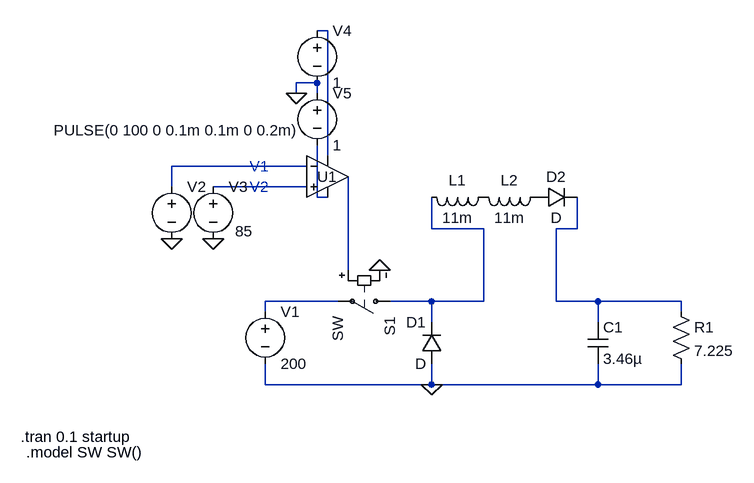
[diagram p0: schematic boostedInductor3.asc]
boostedInductor3.asc, the LTspice schematic file:
Version 4
SHEET 1 880 680
WIRE -48 -288 -64 -288
WIRE -64 -208 -96 -208
WIRE -96 -192 -96 -208
WIRE -64 -192 -64 -208
WIRE -48 -96 -48 -288
WIRE -80 -80 -288 -80
WIRE -288 -48 -288 -80
WIRE -80 -48 -224 -48
WIRE -64 -32 -64 -112
WIRE -48 -32 -64 -32
WIRE 112 16 112 -32
WIRE 192 16 112 16
WIRE 336 16 336 -32
WIRE 336 16 304 16
WIRE -16 80 -16 -64
WIRE -32 128 -144 128
WIRE 112 128 48 128
WIRE 192 128 192 16
WIRE 192 128 112 128
WIRE 304 128 304 16
WIRE 368 128 304 128
WIRE 496 128 368 128
WIRE -144 144 -144 128
WIRE 496 144 496 128
WIRE 112 160 112 128
WIRE 368 160 368 128
WIRE -144 256 -144 224
WIRE 112 256 112 224
WIRE 112 256 -144 256
WIRE 368 256 368 224
WIRE 368 256 112 256
WIRE 496 256 496 224
WIRE 496 256 368 256
FLAG 32 80 0
FLAG 112 256 0
FLAG -288 32 0
FLAG -224 32 0
FLAG -96 -192 0
SYMBOL voltage -144 128 R0
WINDOW 123 0 0 Left 2
WINDOW 39 0 0 Left 2
SYMATTR InstName V1
SYMATTR Value 200
SYMBOL res 480 128 R0
SYMATTR InstName R1
SYMATTR Value 7.225
SYMBOL cap 352 160 R0
SYMATTR InstName C1
SYMATTR Value 3.46µ
SYMBOL diode 128 224 R180
WINDOW 0 24 64 Left 2
WINDOW 3 24 0 Left 2
SYMATTR InstName D1
SYMBOL sw 64 128 R90
SYMATTR InstName S1
SYMBOL ind 208 -48 R90
WINDOW 0 5 56 VBottom 2
WINDOW 3 32 56 VTop 2
SYMATTR InstName L1
SYMATTR Value 11m
SYMBOL ind 288 -48 R90
WINDOW 0 5 56 VBottom 2
WINDOW 3 32 56 VTop 2
SYMATTR InstName L2
SYMATTR Value 11m
SYMBOL diode 272 -16 R270
WINDOW 0 32 32 VTop 2
WINDOW 3 0 32 VBottom 2
SYMATTR InstName D2
SYMBOL Opamps\\UniversalOpamp2 -48 -64 R0
WINDOW 0 -16 0 Left 2
SYMATTR InstName U1
SYMBOL voltage -288 -64 R0
WINDOW 3 -181 -71 Left 2
WINDOW 123 0 0 Left 2
WINDOW 39 0 0 Left 2
SYMATTR Value PULSE(0 100 0 0.1m 0.1m 0 0.2m)
SYMATTR InstName V2
SYMBOL voltage -224 -64 R0
WINDOW 123 0 0 Left 2
WINDOW 39 0 0 Left 2
WINDOW 3 34 84 Left 2
SYMATTR Value 85
SYMATTR InstName V3
SYMBOL voltage -64 -304 R0
WINDOW 123 0 0 Left 2
WINDOW 39 0 0 Left 2
SYMATTR InstName V4
SYMATTR Value 1
SYMBOL voltage -64 -208 R0
WINDOW 123 0 0 Left 2
WINDOW 39 0 0 Left 2
SYMATTR InstName V5
SYMATTR Value 1
TEXT -168 -80 Left 2 ;V1
TEXT -168 -48 Left 2 ;V2
TEXT -520 336 Left 2 !.tran 0.1 startup
TEXT -512 360 Left 2 !.model SW SW()

The netlist it stands for:
* boostedInductor3.asc
V1 N008 0 200
R1 N006 0 7.225
C1 N006 0 3.46µ
D1 0 N005 D
S1 N005 N008 N007 0 SW
L1 P001 N005 11m
L2 P002 P001 11m
D2 P002 N006 D
XU1 N003 N002 N001 N004 N007 level.2 Avol=1Meg GBW=10Meg Slew=10Meg ilimit=25m rail=0 Vos=0 phimargin=45 en=0 enk=0 in=0 ink=0 Rin=500Meg  ; pins IN+ IN- V+ V- OUT
V2 N002 0 PULSE(0 100 0 0.1m 0.1m 0 0.2m)
V3 N003 0 85
V4 N001 0 1
V5 0 N004 1
.model D D
.lib standard.dio
* V1
* V2
.tran 0.1 startup
.model SW SW()
.lib UniversalOpamps2.sub
.backanno
.end